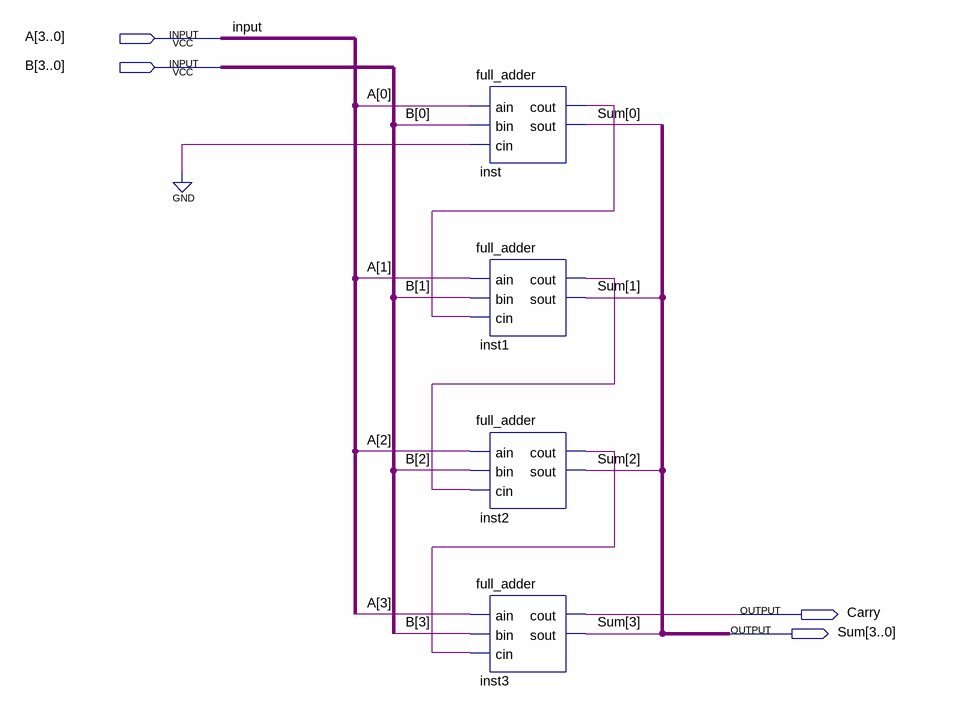
[diagram p0: schematic sheet]
// Quartus schematic fourbit_adder.bdf as structural Verilog: 4 symbols, 4 pins
module fourbit_adder (
  input  [3:0] A,
  input  [3:0] B,
  output Carry,
  output [3:0] Sum
);

  wire inst1_cout, inst2_cout, inst_cout;

  full_adder inst (.ain(A[0]), .bin(B[0]), .cin(1'b0), .cout(inst_cout), .sout(Sum[0]));
  full_adder inst1 (.ain(A[1]), .bin(B[1]), .cin(inst_cout), .cout(inst1_cout), .sout(Sum[1]));
  full_adder inst2 (.ain(A[2]), .bin(B[2]), .cin(inst1_cout), .cout(inst2_cout), .sout(Sum[2]));
  full_adder inst3 (.ain(A[3]), .bin(B[3]), .cin(inst2_cout), .cout(Carry), .sout(Sum[3]));
endmodule
